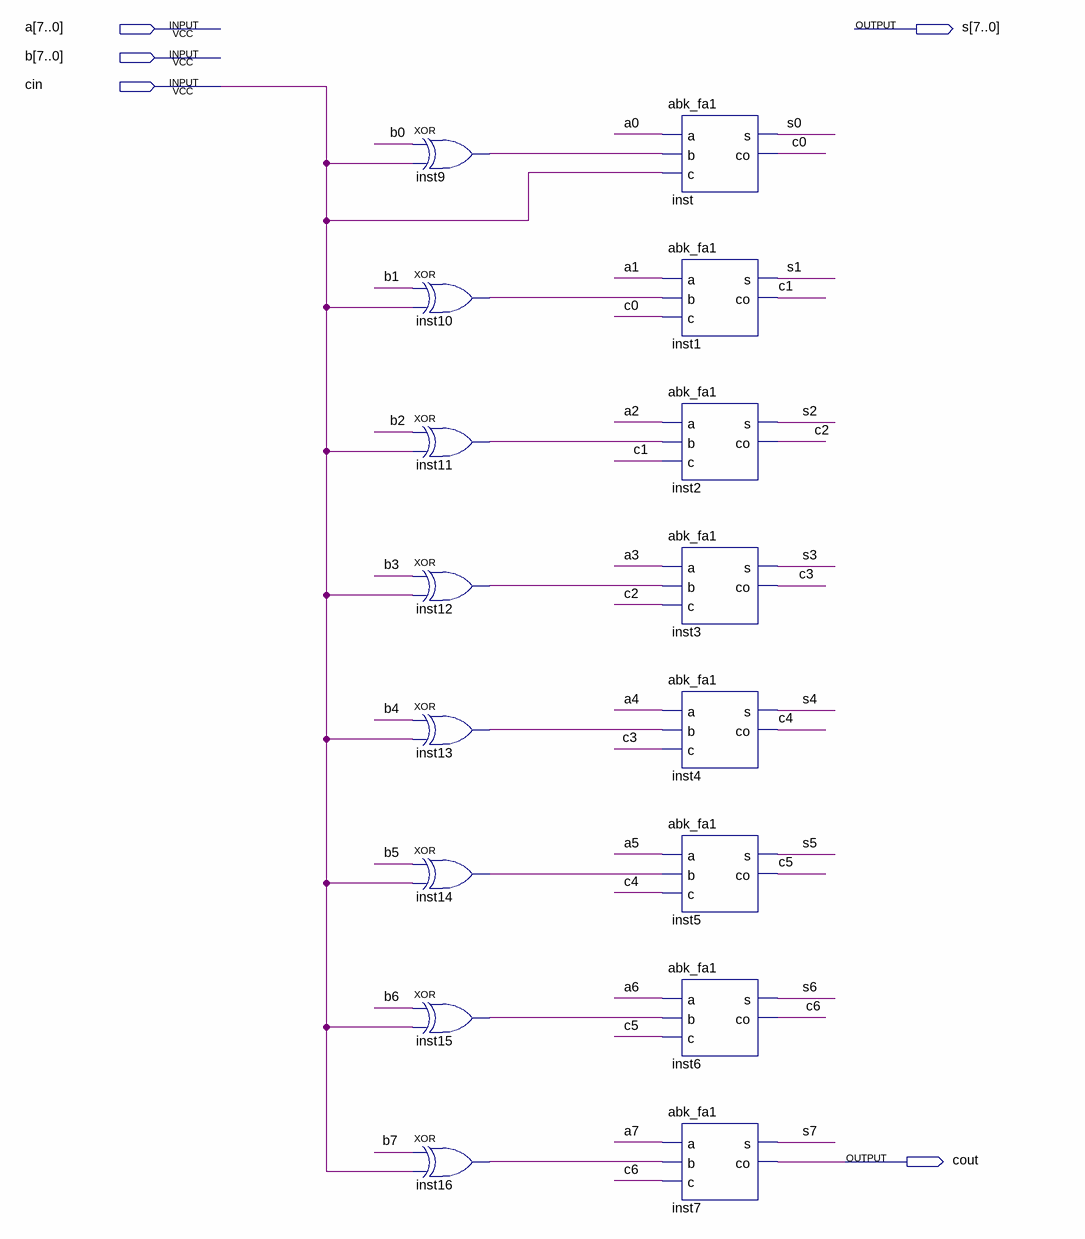
[diagram p0: schematic sheet]
// Quartus schematic abk_somasub8.bdf as structural Verilog: 16 symbols, 5 pins
module abk_somasub8 (
  input  [7:0] a,
  input  [7:0] b,
  input  cin,
  output [7:0] s,
  output cout
);

  wire c0, c1, c2, c3, c4, c5, c6, inst9_out, inst10_out, inst11_out, inst12_out, inst13_out, inst14_out,
       inst15_out, inst16_out;

  xor inst9 (inst9_out, b[0], cin);
  xor inst10 (inst10_out, b[1], cin);
  xor inst11 (inst11_out, b[2], cin);
  xor inst12 (inst12_out, b[3], cin);
  xor inst13 (inst13_out, b[4], cin);
  xor inst14 (inst14_out, b[5], cin);
  xor inst15 (inst15_out, b[6], cin);
  xor inst16 (inst16_out, b[7], cin);
  abk_fa1 inst (.a(a[0]), .b(inst9_out), .c(cin), .s(s[0]), .co(c0));
  abk_fa1 inst1 (.a(a[1]), .b(inst10_out), .c(c0), .s(s[1]), .co(c1));
  abk_fa1 inst2 (.a(a[2]), .b(inst11_out), .c(c1), .s(s[2]), .co(c2));
  abk_fa1 inst3 (.a(a[3]), .b(inst12_out), .c(c2), .s(s[3]), .co(c3));
  abk_fa1 inst4 (.a(a[4]), .b(inst13_out), .c(c3), .s(s[4]), .co(c4));
  abk_fa1 inst5 (.a(a[5]), .b(inst14_out), .c(c4), .s(s[5]), .co(c5));
  abk_fa1 inst6 (.a(a[6]), .b(inst15_out), .c(c5), .s(s[6]), .co(c6));
  abk_fa1 inst7 (.a(a[7]), .b(inst16_out), .c(c6), .s(s[7]), .co(cout));
endmodule
